# EAGLE design schema1 (EAGLE 7.5.0)

## Sheet 1 of 2
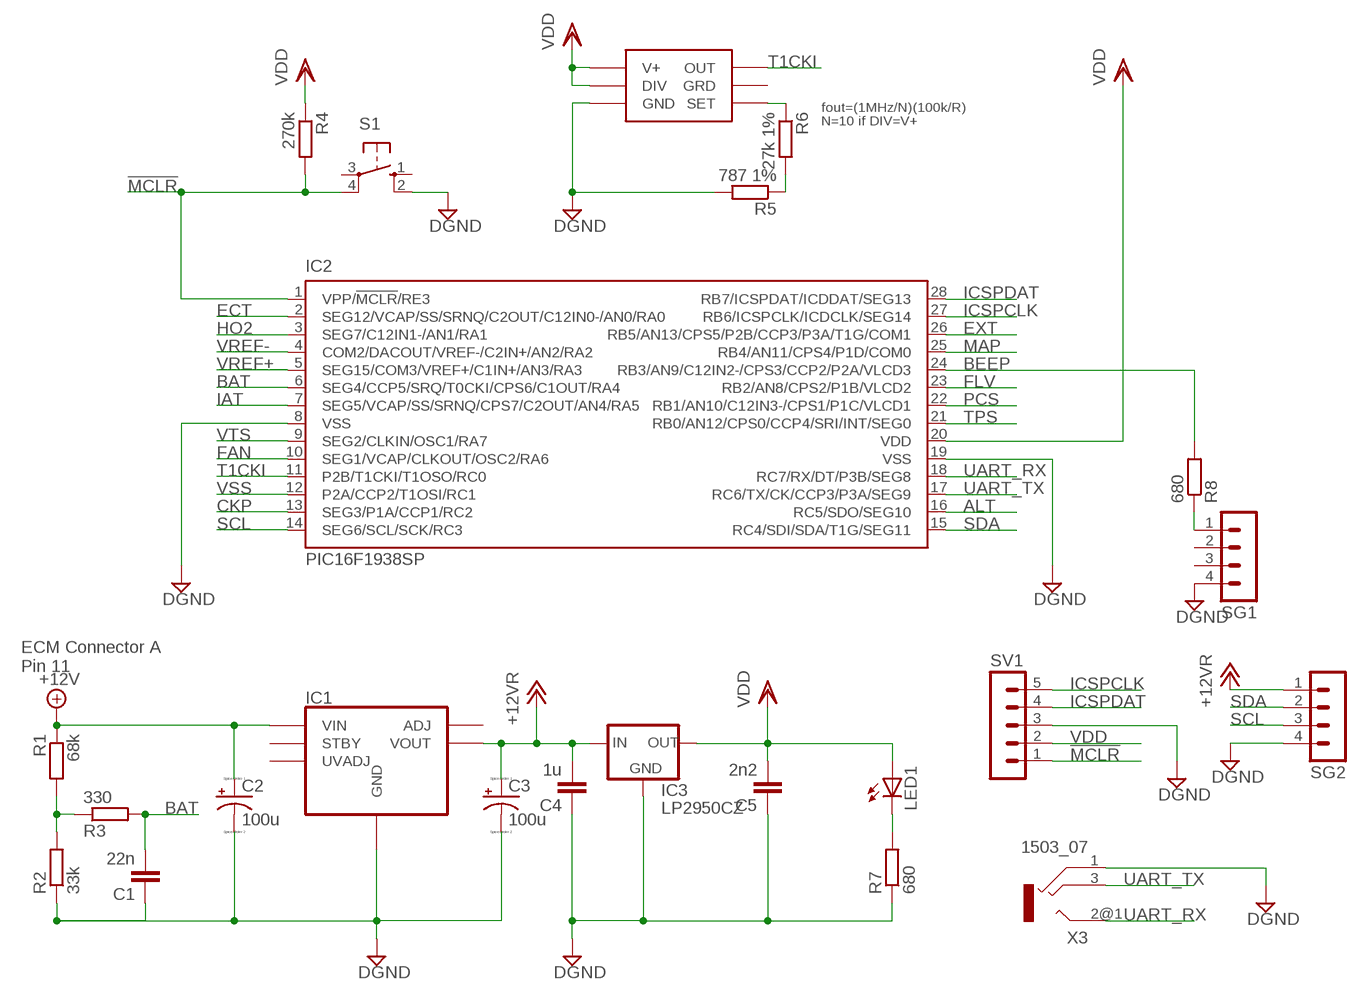
[diagram p0: schematic, sheet 1]

### Parts
C1  22n  C5/3  [C5B3]
C2  100u  CPOL-USE5-10.5  [E5-10,5]
C3  100u  CPOL-USE5-10.5  [E5-10,5]
C4  1u  C5/2.5  [C5B2.5]
C5  2n2  C5/2.5  [C5B2.5]
IC1  EXCALIBURPKG1360  [TI_PKG1360]
IC2  PIC16F1938SP  [DIL28-3]
IC3  LP2950CZ  LP2950CZ-5.0  [TO92]
IC4  LTC6906  [TSOT23-6]
LED1  LEDCHIP-LED0805  [CHIP-LED0805]
R1  68k  R-EU_M1206  [M1206]
R2  33k  R-EU_M1206  [M1206]
R3  330  R-EU_M1206  [M1206]
R4  270k  R-EU_M1206  [M1206]
R5  787 1%  R-EU_M0805  [M0805]
R6  27k 1%  R-EU_M0805  [M0805]
R7  680  R-EU_M1206  [M1206]
R8  680  R-EU_M1206  [M1206]
S1  10-XX  [B3F-10XX]
SG1  MA04-1  [MA04-1]
SG2  MA04-1  [MA04-1]
SV1  MA05-1  [MA05-1]
X3  1503_07  [1503_07]

### Nets
!MCLR: IC2.1(VPP/!MCLR!/RE3) R4.2 S1.4(P1) SV1.1
+12V: C2.+ IC1.P$4(VIN) IC1.P$5(VIN) IC1.P$6(VIN) R1.1 ; also sheet 2
+12VR: C3.+ C4.2 IC1.P$11(VOUT) IC1.P$12(VOUT) IC1.P$13(VOUT) IC3.3(IN) SG2.1
ALT: IC2.16(RC5/SDO/SEG10) ; also sheet 2
BAT: C1.2 IC2.6(SEG4/CCP5/SRQ/T0CKI/CPS6/C1OUT/RA4) R3.2
BEEP: IC2.24(RB3/AN9/C12IN2-/CPS3/CCP2/P2A/VLCD3) R8.2
CKP: IC2.13(SEG3/P1A/CCP1/RC2) ; also sheet 2
DGND: C1.1 C2.- C3.- C4.1 C5.1 IC1.P$7(GND) IC1.P$8(GND) IC1.P$9(GND) IC1.P$10(GND) IC2.8(VSS) IC2.19(VSS) IC3.2(GND) IC4.2(GND) R2.1 R5.2 R7.1 S1.2(S1) SG1.4 SG2.4 SV1.3 X3.1 ; also sheet 2
ECT: IC2.2(SEG12/VCAP/SS/SRNQ/C2OUT/C12IN0-/AN0/RA0) ; also sheet 2
EXT: IC2.26(RB5/AN13/CPS5/P2B/CCP3/P3A/T1G/COM1) ; also sheet 2
FAN: IC2.10(SEG1/VCAP/CLKOUT/OSC2/RA6) ; also sheet 2
FLV: IC2.23(RB2/AN8/CPS2/P1B/VLCD2) ; also sheet 2
HO2: IC2.3(SEG7/C12IN1-/AN1/RA1) ; also sheet 2
IAT: IC2.7(SEG5/VCAP/SS/SRNQ/CPS7/C2OUT/AN4/RA5) ; also sheet 2
ICSPCLK: IC2.27(RB6/ICSPCLK/ICDCLK/SEG14) SV1.5
ICSPDAT: IC2.28(RB7/ICSPDAT/ICDDAT/SEG13) SV1.4
MAP: IC2.25(RB4/AN11/CPS4/P1D/COM0) ; also sheet 2
N$1: R8.1 SG1.1
N$2: IC4.4(SET) R6.1
N$3: LED1.C R7.2
N$6: R5.1 R6.2
N$8: R1.2 R2.2 R3.1
PCS: IC2.22(RB1/AN10/C12IN3-/CPS1/P1C/VLCD1) ; also sheet 2
SCL: IC2.14(SEG6/SCL/SCK/RC3) SG2.3
SDA: IC2.15(RC4/SDI/SDA/T1G/SEG11) SG2.2
T1CKI: IC2.11(P2B/T1CKI/T1OSO/RC0) IC4.1(OUT)
TPS: IC2.21(RB0/AN12/CPS0/CCP4/SRI/INT/SEG0) ; also sheet 2
UART_RX: IC2.18(RC7/RX/DT/P3B/SEG8) X3.2@1
UART_TX: IC2.17(RC6/TX/CK/CCP3/P3A/SEG9) X3.3
VDD [power]: C5.2 IC2.20(VDD) IC3.1(OUT) IC4.3(DIV) IC4.6(V+) LED1.A R4.1 SV1.2
VREF+: IC2.5(SEG15/COM3/VREF+/C1IN+/AN3/RA3) ; also sheet 2
VREF-: IC2.4(COM2/DACOUT/VREF-/C2IN+/AN2/RA2) ; also sheet 2
VSS: IC2.12(P2A/CCP2/T1OSI/RC1) ; also sheet 2
VTS: IC2.9(SEG2/CLKIN/OSC1/RA7) ; also sheet 2
Unconnected: IC1.P$2(UVADJ) IC1.P$3(STBY) IC1.P$14(ADJ) IC4.5(GRD) S1.1(S) S1.3(P) SG1.2 SG1.3 X3.2@2

### Notes on the sheet
- fout=(1MHz/N)(100k/R)
  N=10 if DIV=V+
- ECM Connector A
  Pin 11

## Sheet 2 of 2
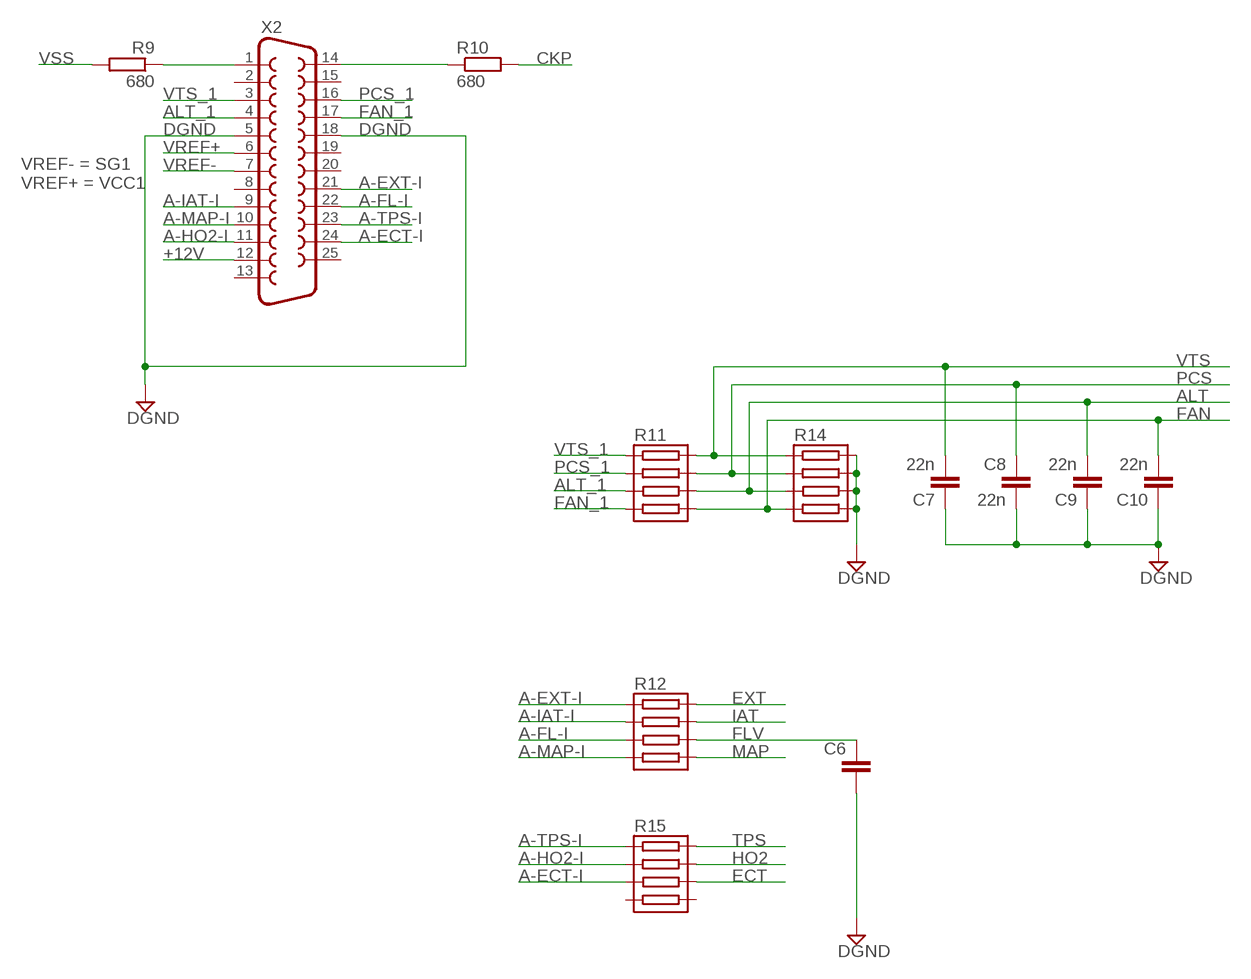
[diagram p1: schematic, sheet 2]

### Parts
C6  C5/3  [C5B3]
C7  22n  C5/3  [C5B3]
C8  22n  C5/3  [C5B3]
C9  22n  C5/3  [C5B3]
C10  22n  C5/3  [C5B3]
R9  680  R-EU_M1206  [M1206]
R10  680  R-EU_M1206  [M1206]
R11  RESISTOR_ARRAY  [RES_ARRAY_DIP_4]
R12  RESISTOR_ARRAY  [RES_ARRAY_DIP_4]
R14  RESISTOR_ARRAY  [RES_ARRAY_DIP_4]
R15  RESISTOR_ARRAY  [RES_ARRAY_DIP_4]
X2  F25H  [F25H]

### Nets
+12V: X2.12 ; also sheet 1
A-ECT-I: R15.P$5 X2.24
A-EXT-I: R12.P$1 X2.21
A-FL-I: R12.P$5 X2.22
A-HO2-I: R15.P$3 X2.11
A-IAT-I: R12.P$3 X2.9
A-MAP-I: R12.P$7 X2.10
A-TPS-I: R15.P$1 X2.23
ALT: C9.2 R11.P$6 R14.P$5 ; also sheet 1
ALT_1: R11.P$5 X2.4
CKP: R10.2 ; also sheet 1
DGND: C6.2 C7.1 C8.2 C9.1 C10.1 R14.P$2 R14.P$4 R14.P$6 R14.P$8 X2.5 X2.18 ; also sheet 1
ECT: R15.P$6 ; also sheet 1
EXT: R12.P$2 ; also sheet 1
FAN: C10.2 R11.P$8 R14.P$7 ; also sheet 1
FAN_1: R11.P$7 X2.17
FLV: C6.1 R12.P$6 ; also sheet 1
HO2: R15.P$4 ; also sheet 1
IAT: R12.P$4 ; also sheet 1
MAP: R12.P$8 ; also sheet 1
N$7: R9.1 X2.1
N$9: R10.1 X2.14
PCS: C8.1 R11.P$4 R14.P$3 ; also sheet 1
PCS_1: R11.P$3 X2.16
TPS: R15.P$2 ; also sheet 1
VREF+: X2.6 ; also sheet 1
VREF-: X2.7 ; also sheet 1
VSS: R9.2 ; also sheet 1
VTS: C7.2 R11.P$2 R14.P$1 ; also sheet 1
VTS_1: R11.P$1 X2.3
Unconnected: R15.P$7 R15.P$8 X2.2 X2.8 X2.13 X2.15 X2.19 X2.20 X2.25

### Notes on the sheet
- VREF- = SG1
  VREF+ = VCC1

## Library data of the parts
C1 C4-C10 = capacitor-wima:C: CAPACITOR naming: grid - package width
C2 C3 = resistor:CPOL-US: POLARIZED CAPACITOR, American symbol
IC1 = julio:EXCALIBUR: EXCALIBUR PT5071 The PT5071 is a 1.5-ampere rated step-up/ step-down Integrated Switching Regulator (ISR) that provides a tightly regulated 12V output voltage from a 7V to 16V variable input source. This high-performance ISR has applications in systems where the input voltage straddles the desired 12V output. The regulator has an adjustable output voltage and input start-up threshold, and a standby function for power conservation.
IC2 = microchip:PIC16F19*: Flash-Based, 8-Bit CMOS Microcontrollers wtih LCD Driver and nanoWatt XLP Technology Auto generated by make-symbol-device-package-bsdl.ulp Rev. 33 Source: http://ww1.microchip.com/downloads/en/DeviceDoc/41364D.pdf; MPN: PIC16F1938-I/SP; OC_FARNELL: 1755829; OC_NEWARK: 08R1949
IC3 = v-reg:LP2950?*: Source: http://cache.national.com/ds/LP/LP2950.pdf
IC4 = linear-technology:LTC6906
LED1 = led:LED: LED OSRAM: - CHIPLED LG R971, LG N971, LY N971, LG Q971, LY Q971, LO R971, LY R971 LH N974, LH R974 LS Q976, LO Q976, LY Q976 LO Q996 - Hyper CHIPLED LW Q18S LB Q993, LB Q99A, LB R99A - SideLED LS A670, LO A670, LY A670, LG A670, LP A670 LB A673, LV A673, LT A673, LW A673 LH A674 LY A675 LS A676, LA A676, LO A676, LY A676, LW A676 LS A679, LY A679, LG A679 - Hyper Micro SIDELED® LS Y876, LA Y876, LO Y876, LY Y876 LT Y87S - SmartLED LW L88C, LW L88S LB L89C, LB L89S, LG L890 LS L89K, LO L89K, LY L89K LS L896, LA L896, LO L896, LY L896 - TOPLED LS T670, LO T670, LY T670, LG T670, LP T670 LSG T670, LSP T670, LSY T670, LOP T670, LYG T670 LG T671, LOG T671, LSG T671 LB T673, LV T673, LT T673, LW T673 LH T674 LS T676, LA T676, LO T676, LY T676, LB T676, LH T676, LSB T676, LW T676 LB T67C, LV T67C, LT T67C, LS T67K, LO T67K, LY T67K, LW E67C LS E67B, LA E67B, LO E67B, LY E67B, LB E67C, LV E67C, LT E67C LW T67C LS T679, LY T679, LG T679 LS T770, LO T770, LY T770, LG T770, LP T770 LB T773, LV T773, LT T773, LW T773 LH T774 LS E675, LA E675, LY E675, LS T675 LS T776, LA T776, LO T776, LY T776, LB T776 LHGB T686 LT T68C, LB T68C - Hyper Mini TOPLED® LB M676 - Mini TOPLED Santana® LG M470 LS M47K, LO M47K, LY M47K Source: http://www.osram.convergy.de LUXEON: - LUMILED® LXK2-PW12-R00, LXK2-PW12-S00, LXK2-PW14-U00, LXK2-PW14-V00 LXK2-PM12-R00, LXK2-PM12-S00, LXK2-PM14-U00 LXK2-PE12-Q00, LXK2-PE12-R00, LXK2-PE12-S00, LXK2-PE14-T00, LXK2-PE14-U00 LXK2-PB12-K00, LXK2-PB12-L00, LXK2-PB12-M00, LXK2-PB14-N00, LXK2-PB14-P00, LXK2-PB14-Q00 LXK2-PR12-L00, LXK2-PR12-M00, LXK2-PR14-Q00, LXK2-PR14-R00 LXK2-PD12-Q00, LXK2-PD12-R00, LXK2-PD12-S00 LXK2-PH12-R00, LXK2-PH12-S00 LXK2-PL12-P00, LXK2-PL12-Q00, LXK2-PL12-R00 Source: www.luxeon.com KINGBRIGHT: KA-3528ASYC Source: www.kingbright.com
R1-R10 = resistor:R-EU_: RESISTOR, European symbol
R11 R12 R15 = julio:RESISTOR_ARRAY: BI Technologies Resistor arrays; MPN: SIL 8-4; R17: 68K
R14 = julio:RESISTOR_ARRAY: BI Technologies Resistor arrays; MPN: SIL 8-4
S1 = switch-omron:10-XX: OMRON SWITCH; MPN: B3F-1000; OC_FARNELL: 176432; OC_NEWARK: 36M3542
SG1 SG2 = con-lstb:MA04-1: PIN HEADER; OC_FARNELL: unknown; OC_NEWARK: unknown
SV1 = con-lstb:MA05-1: PIN HEADER; OC_FARNELL: unknown; OC_NEWARK: unknown
X2 = con-subd:F25: SUB-D; OC_FARNELL: unknown; OC_NEWARK: unknown
X3 = con-lumberg:1503_?: Jack connectors according to JISC 6560, 3.5 mm Klinkensteckverbinder nach JISC 6560, 3,5 mm Source: http://www.lumberg.com/Produkte/PDFs/1503_08.pdf; OC_FARNELL: unknown; OC_NEWARK: unknown

## Net classes
1 power: width 0.8 mm
2 gnd: width 0.5 mm

## Board
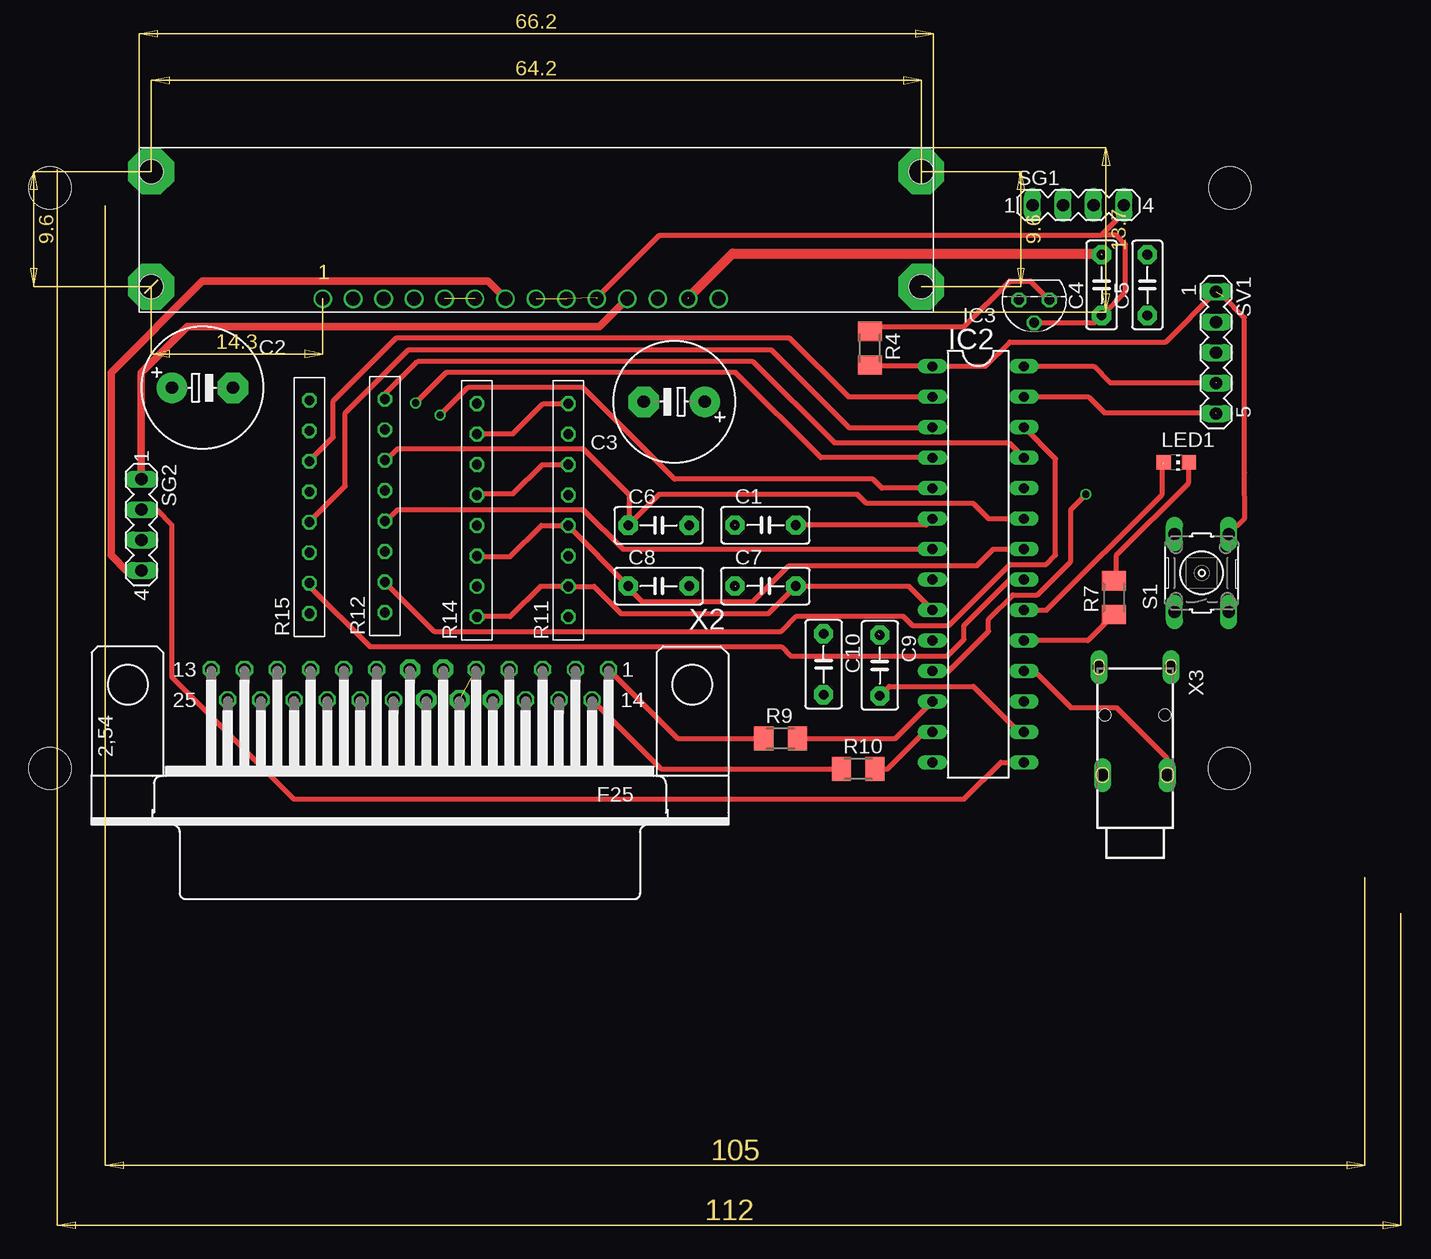
[diagram p2: board, top side]
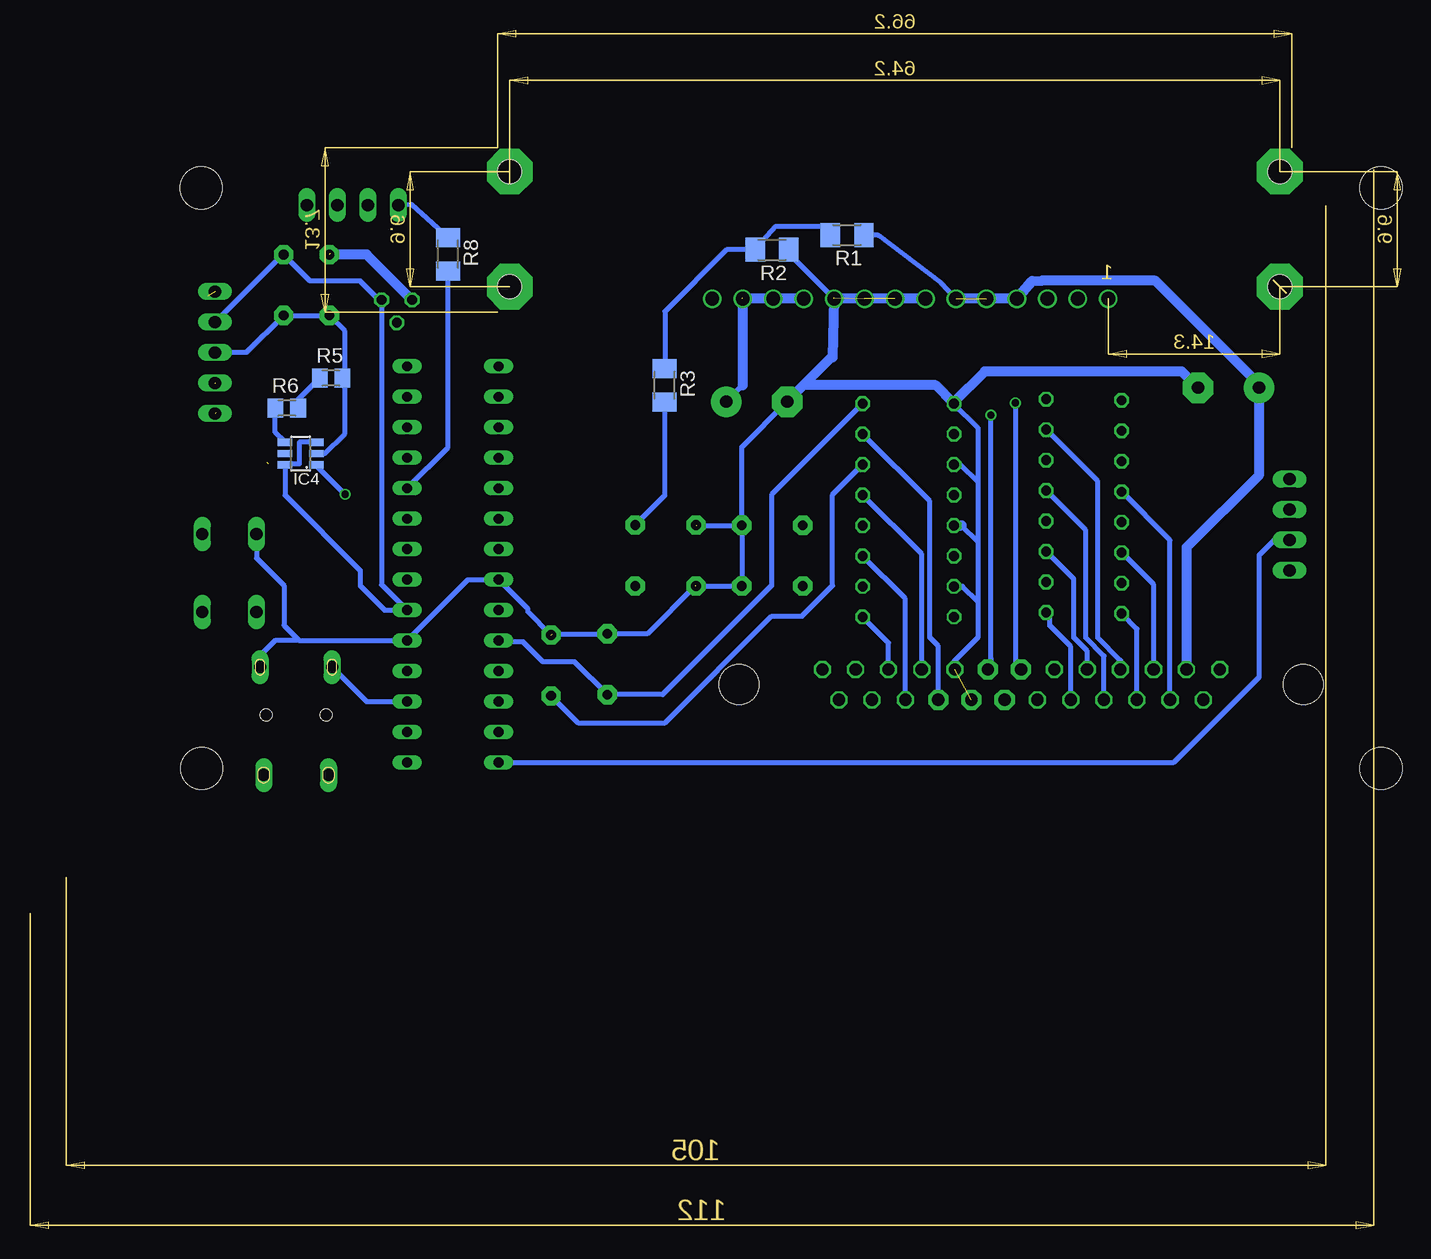
[diagram p3: board, bottom side, seen from below]

Size 90 x 27.3 mm. Coordinates in mm from the lower left corner, seen from the top.
Copper layers (1+2*15+16): Top 0.035mm / dielectric 0.36mm / layer 2 0.035mm / dielectric 0.71mm / layer 15 0.035mm / dielectric 0.36mm / Bottom 0.035mm
Design rules "PCB-Joker-Eagle-DRU-v1-0 *": minimum track width 6mil, minimum drill 0.3mm, track to track 6mil, track to pad 6mil, pad to pad 6mil, via to via 6mil, smd to smd 6mil, copper to edge 20mil, drill to drill 10mil, minimum pad ring 8mil, minimum via ring 6mil, stop-mask expansion 3mil, vias tented up to drill 0mil, thermal gap 8mil
Holes 3.5 mm at 1.67,-34.27 99.97,-34.27 1.67,14.13 100.02,14.13

### Footprints (pad centres in the part's own frame; a part is rotated, then mirrored left to right if it is on the bottom)
C5B3 = drill 0.813 pad 1.6 octagon: 1 -2.54,0; 2 2.54,0
E5-10,5 = drill 1.016 pad 2.54: + -2.54,0 | drill 1.016 pad 2.54 octagon: - 2.54,0
C5B2.5 = drill 0.813 pad 1.6 octagon: 1 -2.54,0; 2 2.54,0
TI_PKG1360 = drill 1.143: P$1 0,0; P$2 2.54,0; P$3 5.08,0; P$4 7.62,0; P$5 10.16,0; P$6 12.7,0; P$7 15.24,0; P$8 17.78,0; P$9 20.32,0; P$10 22.86,0; P$11 25.4,0; P$12 27.94,0; P$13 30.48,0; P$14 33.02,0 | drill 2 pad 3.81 octagon: P$15 -14.3,10.6; P$16 -14.3,1; P$17 49.9,1; P$18 49.9,10.6 | hole 2: -14.3,1; -14.3,10.6; 49.9,10.6; 49.9,1
DIL28-3 = drill 0.813 long: 1 -16.51,-3.81; 2 -13.97,-3.81; 3 -11.43,-3.81; 4 -8.89,-3.81; 5 -6.35,-3.81; 6 -3.81,-3.81; 7 -1.27,-3.81; 8 1.27,-3.81; 9 3.81,-3.81; 10 6.35,-3.81; 11 8.89,-3.81; 12 11.43,-3.81; 13 13.97,-3.81; 14 16.51,-3.81; 15 16.51,3.81; 16 13.97,3.81; 17 11.43,3.81; 18 8.89,3.81; 19 6.35,3.81; 20 3.81,3.81; 21 1.27,3.81; 22 -1.27,3.81; 23 -3.81,3.81; 24 -6.35,3.81; 25 -8.89,3.81; 26 -11.43,3.81; 27 -13.97,3.81; 28 -16.51,3.81
TO92 = drill 0.813 octagon: 1 -1.27,0; 2 0,1.905; 3 1.27,0
TSOT23-6 = smd 0.62 x 1.22: 1 -0.95,-1.3; 2 0,-1.3; 3 0.95,-1.3; 4 0.95,1.3; 5 0,1.3; 6 -0.95,1.3
CHIP-LED0805 = smd 1.2 x 1.2: A 0,-1.05; C 0,1.05
M1206 = smd 1.6 x 2: 1 -1.4,0; 2 1.4,0
M0805 = smd 1.3 x 1.6: 1 -0.95,0; 2 0.95,0
RES_ARRAY_DIP_4 = drill 0.813 octagon: P$1 0,0; P$2 2.54,0; P$3 5.08,0; P$4 7.62,0; P$5 10.16,0; P$6 12.7,0; P$7 15.24,0; P$8 17.78,0
B3F-10XX = drill 1.016 long: 1 -3.251,2.261; 2 3.251,2.261; 3 -3.251,-2.261; 4 3.251,-2.261
MA04-1 = drill 1.016 long: 1 -3.81,0; 2 -1.27,0; 3 1.27,0; 4 3.81,0
MA05-1 = drill 1.016 long: 1 -5.08,0; 2 -2.54,0; 3 0,0; 4 2.54,0; 5 5.08,0
F25H = drill 1.016 octagon: 1 -16.561,-1.27; 2 -13.792,-1.27; 3 -11.049,-1.27; 4 -8.28,-1.27; 5 -5.512,-1.27; 8 2.769,-1.27; 9 5.512,-1.27; 10 8.28,-1.27; 11 11.049,-1.27; 12 13.792,-1.27; 13 16.561,-1.27; 14 -15.189,1.27; 15 -12.421,1.27; 16 -9.652,1.27; 20 1.372,1.27; 21 4.14,1.27; 22 6.909,1.27; 23 9.652,1.27; 24 12.421,1.27; 25 15.189,1.27 | drill 1.016 pad 1.67 octagon: 6 -2.769,-1.27; 7 0,-1.27; 17 -6.909,1.27; 18 -4.14,1.27; 19 -1.372,1.27 | hole 3.302: -23.52,0; 23.52,0
1503_07 = drill 1 pad 1.2 long: 1 -3,-11; 2@1 -2.7,-2; 2@2 2.7,-2; 3 3,-11 | hole 1: -2.5,-7; 2.5,-7

### Placement (x,y rotation side)
C1  61.3,-13.98 0 top  (outside the outline)
C2  14.37,-2.52 0 top
C3  53.71,-3.69 180 top  (outside the outline)
C4  89.34,6.04 90 top
C5  93.15,6.04 90 top  (outside the outline)
C6  52.41,-14 0 top  (outside the outline)
C7  61.3,-19.06 0 top  (outside the outline)
C8  52.41,-19.06 0 top  (outside the outline)
C9  70.84,-25.67 270 top  (outside the outline)
C10  66.16,-25.57 270 top  (outside the outline)
IC1  24.4,4.9 0 top
IC2  79.04,-17.25 270 top
IC3  83.71,4.8 180 top
IC4  91.73,-8.01 90 bottom  (outside the outline)
LED1  95.55,-8.75 270 top  (outside the outline)
R1  46.18,10.21 180 bottom
R2  52.44,8.97 180 bottom
R3  61.39,-2.33 270 bottom
R4  70.01,0.77 270 top
R5  89.19,-1.73 0 bottom
R6  92.89,-4.23 0 bottom  (outside the outline)
R7  90.35,-20.02 90 top  (outside the outline)
R8  79.45,8.6 270 bottom
R9  62.57,-31.76 0 top  (outside the outline)
R10  69.04,-34.3 0 top  (outside the outline)
R11  44.88,-21.63 90 top  (outside the outline)
R12  29.58,-21.26 90 top  (outside the outline)
R14  37.26,-21.63 90 top  (outside the outline)
R15  23.29,-21.35 90 top  (outside the outline)
S1  97.67,-17.97 90 top  (outside the outline)
SG1  87.39,12.7 0 top
SG2  9.29,-13.95 270 top  (outside the outline)
SV1  98.87,0.41 270 top  (outside the outline)
X2  31.67,-27.27 180 top  (outside the outline)
X3  92.11,-36.81 180 top  (outside the outline)

### Tracks (layer width: path | path; a pad name or v marks a point on that pad's centre or on a via)
!MCLR  (1 unrouted)
  Top 0.406: SV1.1 94.67,1.29 81.68,1.29 79.65,-0.74 IC2.1 70.12,-0.74 R4.2 | 99.46,5.1 101.24,3.32 101.24,-9.63 101.26,-13.42 S1.4
+12V  (1 unrouted)
  Bottom 0.406: IC1.P$6 38.37,6.24 43.58,10.18 44.75,10.18
  Bottom 0.813: 17.93,-26.05 X2.12 17.88,-15.84 11.83,-9.79 C2.+ 11.83,-2.25 20.48,6.4 29.97,6.4 30.75,6.38 IC1.P$4 IC1.P$6 | 44.75,10.18 R1.1
+12VR  (2 unrouted)
  Top 0.61: SG2.1 9.29,-1.25 13.1,2.56 47.46,2.56 IC1.P$11
  Top 0.813: 54.88,4.97 58.57,8.66 89.26,8.66
  Bottom 0.406: 54.88,-2.32 C3.+
  Bottom 0.813: IC1.P$11 IC1.P$12 IC1.P$13 54.88,-2.32 | IC3.3 86.22,8.58 C4.2
A-ECT-I
  Bottom 0.406: X2.24 19.25,-15.23 R15.P$5
A-EXT-I
  Bottom 0.406: X2.21 27.53,-24.11 29.29,-22.35 29.29,-21.55 R12.P$1
A-FL-I
  Bottom 0.406: X2.22 24.76,-24.88 26.29,-23.35 26.29,-14.39 R12.P$5
A-HO2-I
  Bottom 0.406: X2.11 20.62,-18.94 R15.P$3
A-IAT-I
  Bottom 0.406: X2.9 26.16,-24.48 27.29,-23.35 27.29,-18.47 R12.P$3
A-MAP-I
  Bottom 0.406: X2.10 23.39,-25.25 25.29,-23.35 25.29,-10.31 R12.P$7
A-TPS-I
  Bottom 0.406: X2.23 22.02,-22.62 R15.P$1
ALT
  Top 0.406: R14.P$5 37.38,-11.35 40.29,-11.35 42.71,-8.93 R11.P$6 | C9.2 71.64,-27.41 78.63,-27.41 82.44,-31.22 IC2.16
  Bottom 0.406: C9.2 68.59,-30.46 61.36,-30.46 52.47,-21.57 49.93,-21.57 47.39,-19.03 47.39,-11.44 R11.P$6
ALT_1
  Bottom 0.406: X2.4 39.95,-16.4 R11.P$5
BAT
  Top 0.406: IC2.6 74.69,-13.98 C1.2
  Bottom 0.406: R3.2 61.39,-11.53 C1.2
BEEP
  Bottom 0.406: IC2.24 79.45,-7.5 R8.2
CKP
  Top 0.406: R10.2 71.49,-34.3 74.57,-31.22 IC2.13
DGND  (7 unrouted)
  Top 0.406: R7.1 88.17,-23.6 IC2.19 | IC3.2 88.73,2.89 C4.1 91.33,5.49 91.33,9.42 90.57,10.18 89.3,10.18 | 47.26,4.97 52.47,10.18 89.3,10.18 | 89.3,10.18 91.2,12.08 SG1.4
  Top 0.61: SG2.4 8.02,-17.76 6.75,-16.49 6.75,-1.25 14.37,6.37 38.17,6.37 IC1.P$7
  Bottom 0.406: R14.P$8 37.3,-3.85 35.29,-5.86 35.29,-10.35 | 35.29,-10.35 35.29,-15.35 | 35.29,-15.35 35.29,-20.35 | 35.29,-20.35 35.29,-23.35 37.29,-25.35 37.29,-25.89 X2.5 | R14.P$6 36.71,-8.93 35.29,-10.35 | 36.63,-14.01 35.29,-15.35 | R14.P$2 36.55,-19.09 35.29,-20.35 | SV1.3 96.26,0.41 C5.1 C4.1 88.03,2.19 88.03,-2.52 | R2.1 51.11,8.75 IC1.P$10 | C9.1 72.79,-21.18 72.79,-20.96 IC2.8 77.77,-18.52 IC2.19 91.84,-23.6 | 70.75,-23.03 C10.1 62.82,-23.03 58.85,-19.06 | C6.2 C8.2 C7.1 | 58.74,-14 C6.2 | IC4.2 89.71,-8.01 88.03,-6.33 88.03,-2.52 | C6.2 54.95,-7.47 C3.- | S1.2 95.41,-16.73 93.11,-19.03 93.11,-22.33 91.84,-23.6 | 91.84,-23.6 93.87,-23.6 95.11,-24.84 X3.1 | R5.2 88.24,-2.31 88.03,-2.52
  Bottom 0.813: R14.P$4 36.63,-14.01 | 49.8,-2.32 47.46,0.02 47.39,0.02 IC1.P$10 IC1.P$7 | 49.8,-2.32 C3.- | 49.8,-2.32 38.79,-2.32 R14.P$8 37.26,-3.73 34.69,-1.16 18.27,-1.16 C2.-
ECT
  Top 0.406: IC2.2 68.22,-3.28 63.29,1.65 30.56,1.65 25.29,-3.62 25.29,-6.65 R15.P$6
EXT
  Top 0.406: R12.P$2 33.7,-22.84 62.63,-22.84 63.9,-21.57 72.79,-21.57 73.55,-22.33 76.6,-22.33 81.68,-17.25 84.73,-17.25 85.49,-16.49 85.49,-8.46 IC2.26
FAN
  Top 0.406: R14.P$7 37.3,-6.35 40.29,-6.35 42.79,-3.85 R11.P$8
  Bottom 0.406: IC2.10 75.14,-23.69 73.21,-23.69 71.52,-25.38 68.89,-25.38 C10.2 61.55,-28.11 52.47,-19.03 52.47,-11.44 R11.P$8
FAN_1
  Bottom 0.406: X2.17 38.58,-24.06 39.29,-23.35 39.29,-11.98 R11.P$7
FLV
  Top 0.406: IC2.23 79.9,-13.44 78.63,-12.17 69.74,-12.17 68.98,-11.41 52.46,-11.41 C6.1 49.93,-13.94 49.93,-11.41 46.12,-7.6 30.63,-7.6 29.67,-8.56 R12.P$6
HO2
  Top 0.406: IC2.3 75.27,-5.86 68.29,-5.86 61.78,0.65 31.56,0.65 26.29,-4.62 26.29,-10.73 R15.P$4
IAT
  Top 0.406: R12.P$4 29.67,-13.64 30.63,-12.68 46.12,-12.68 49.42,-15.98 74.21,-15.98 IC2.7
ICSPCLK  (1 unrouted)
  Top 0.406: IC2.27 88.22,-3.28 89.54,-4.6 98.8,-4.6
ICSPDAT  (1 unrouted)
  Top 0.406: IC2.28 88.68,-0.74 90.04,-2.1 98.9,-2.1
MAP
  Top 0.406: R12.P$8 29.58,-3.06 32.29,-0.35 60.29,-0.35 67.05,-7.11 81.6,-7.11 IC2.25
N$1
  Bottom 0.406: R8.1 82.48,12.74 SG1.1
N$2
  Bottom 0.406: IC4.4 93.84,-6.25 R6.1
N$3
  Top 0.406: R7.2 90.57,-18.4 90.57,-16.49 96.6,-10.46 LED1.C
N$6
  Bottom 0.406: R5.1 91.94,-3.51 R6.2
N$7
  Top 0.406: X2.1 53.99,-31.76 R9.1
N$8
  Bottom 0.406: 61.36,-0.9 61.36,3.83 56.22,8.97 R2.2 52.12,10.94 48.15,10.94 47.58,10.37 R1.2
  Bottom 0.813: R1.2 arc45 47.73,10.15 | 61.36,-0.9 R3.1
N$9
  Top 0.406: X2.14 52.62,-34.3 R10.1
PCS
  Top 0.406: R14.P$3 37.21,-16.6 40.04,-16.6 42.63,-14.01 R11.P$4 44.88,-14.07 C8.1 49.73,-19.06 51.02,-20.35 60.29,-20.35 63.27,-17.37 78.92,-17.37 80.31,-15.98 IC2.22
PCS_1
  Bottom 0.406: X2.16 41.32,-20.11 R11.P$3
SCL
  Bottom 0.406: IC2.14 18.94,-33.76 11.83,-26.65 11.83,-16.49 10.56,-15.22 SG2.3
SDA
  Top 0.406: SG2.2 10.56,-12.68 11.83,-13.95 11.83,-26.65 21.99,-36.81 77.87,-36.81 80.92,-33.76 IC2.15
T1CKI  (via drill 0.6)
  Top 0.406: IC2.11 76.6,-26.14 79.9,-22.84 79.9,-21.82 81.93,-19.79 83.97,-19.79 86.76,-17 86.76,-12.68 v88.03,-11.41
  Bottom 0.406: IC4.1 90.43,-9.01 v88.03,-11.41
TPS
  Top 0.406: R15.P$2 23.29,-19.06 28.34,-24.11 62.63,-24.11 63.39,-24.87 76.5,-24.87 77.87,-23.5 77.87,-22.33 81.68,-18.52 IC2.21
UART_RX
  Top 0.406: X3.2@1 94.81,-33.43 90.57,-29.19 86.76,-29.19 83.71,-26.14 IC2.18
UART_TX
  Bottom 0.406: X3.3 86.24,-28.68 IC2.17
VDD  (1 unrouted)
  Top 0.406: 94.38,-8.87 94.38,-11.41 84.73,-21.06 IC2.20 | IC3.1 83.41,6.37 81.68,6.37 77.87,2.56 70.4,2.56 R4.1
  Bottom 0.406: SV1.2 93.24,8.58 C5.2 90.94,6.37 86.76,6.37 85.19,4.8 IC3.1 84.98,-18.93 IC2.20 84.73,-21.06 86.76,-19.03 86.76,-17.76 93.03,-11.49 IC4.6 93.03,-8.87 91.84,-8.87 91.84,-7.06 IC4.3
VREF+  (via drill 0.6)
  Top 0.406: IC2.5 71.01,-10.9 70.25,-10.14 53.74,-10.14 46.12,-2.52 36.47,-2.52 v34.18,-4.81
  Bottom 0.406: X2.6 34.04,-26 34.18,-25.13 v34.18,-4.81
VREF-  (via drill 0.6)
  Top 0.406: IC2.4 65.93,-8.36 58.82,-1.25 34.69,-1.25 v32.15,-3.79
  Bottom 0.406: v32.15,-3.79 32.15,-25.52 X2.7
VSS
  Top 0.406: R9.2 72.15,-31.76 IC2.12
VTS
  Top 0.406: R14.P$1 37.29,-21.6 40.04,-21.6 42.55,-19.09 R11.P$2 47.03,-19.09 49.29,-21.35 61.55,-21.35 C7.2 73.23,-19.06 IC2.9
VTS_1
  Bottom 0.406: X2.3 42.72,-23.79 R11.P$1